# EAGLE design pmod-level-conv (EAGLE 7.7.0)
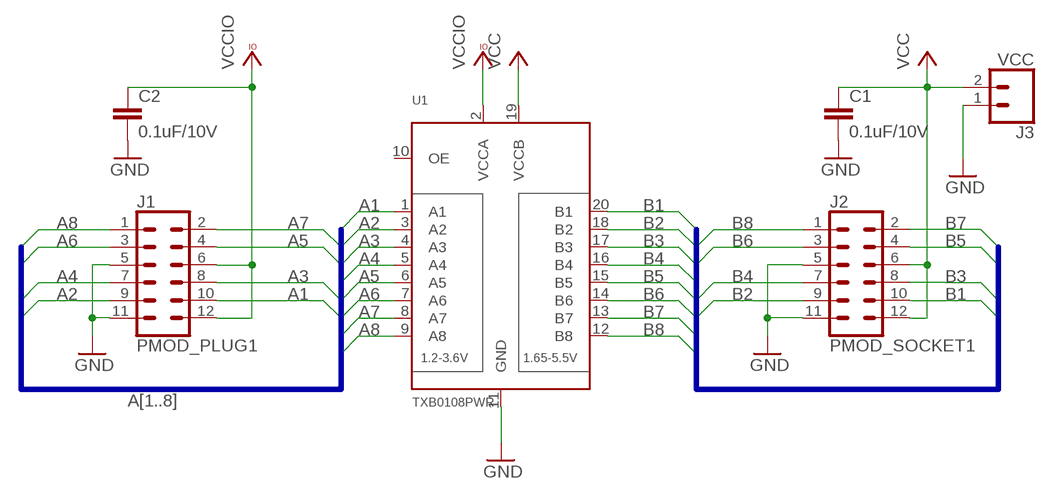
[diagram p0: schematic, sheet 1]

## Parts
C1  0.1uF/10V  C-EUC0603K  [C0603K]
C2  0.1uF/10V  C-EUC0603K  [C0603K]
J1  PMOD_PLUG1  CONN_06X2SMD_RA_PLUG  [2X6_SMD_RA_PLUG]
J2  PMOD_SOCKET1  CONN_06X2SMD_RA_SOCKET  [2X6_SMD_RA_SOCKET]
J3  VCC  CONN_02-JST-2MM-SMT  [JST-2-SMD]
U1  TXB0108PWR  [TSSOP20]

## Nets
A1: J1.10 U1.1(A1)
A2: J1.9 U1.3(A2)
A3: J1.8 U1.4(A3)
A4: J1.7 U1.5(A4)
A5: J1.4 U1.6(A5)
A6: J1.3 U1.7(A6)
A7: J1.2 U1.8(A7)
A8: J1.1 U1.9(A8)
B1: J2.10 U1.20(B1)
B2: J2.9 U1.18(B2)
B3: J2.8 U1.17(B3)
B4: J2.7 U1.16(B4)
B5: J2.4 U1.15(B5)
B6: J2.3 U1.14(B6)
B7: J2.2 U1.13(B7)
B8: J2.1 U1.12(B8)
GND: C1.2 C2.2 J1.5 J1.11 J2.5 J2.11 J3.1 U1.11(GND)
VCC: C1.1 J2.6 J2.12 J3.2 U1.19(VCCB)
VCCIO: C2.1 J1.6 J1.12 U1.2(VCCA)
Unconnected: U1.10(OE)

## Buses
A[1..8]
B[1..8]

## Library data of the parts
C1 C2 = rcl:C-EU: CAPACITOR, European symbol; SPICEPREFIX: C
J1 J2 = mechanical:CONN_06X2: Multi connection point. Often used as Generic Header-pin footprint for 0.1 inch spaced/style header connections On any of the 0.1 inch spaced packages, you can populate with these: Break Away Headers - Straight <https://www.sparkfun.com/products/116> (PRT-00116) Break Away Male Headers - Right Angle <https://www.sparkfun.com/products/553> (PRT-00553) Female Headers <https://www.sparkfun.com/products/115> (PRT-00115) Break Away Headers - Machine Pin <https://www.sparkfun.com/products/117> (PRT-00117) Break Away Female Headers - Swiss Machine Pin <https://www.sparkfun.com/products/743> (PRT-00743)
J3 = SparkFun-Connectors:CONN_02: Multi connection point. Often used as Generic Header-pin footprint for 0.1 inch spaced/style header connections On any of the 0.1 inch spaced packages, you can populate with these: Break Away Headers - Straight <https://www.sparkfun.com/products/116> (PRT-00116) Break Away Male Headers - Right Angle <https://www.sparkfun.com/products/553> (PRT-00553) Female Headers <https://www.sparkfun.com/products/115> (PRT-00115) Break Away Headers - Machine Pin <https://www.sparkfun.com/products/117> (PRT-00117) Break Away Female Headers - Swiss Machine Pin <https://www.sparkfun.com/products/743> (PRT-00743) For SCREWTERMINALS and SPRING TERMINALS visit here: Screw Terimnals on SparkFun.com <https://www.sparkfun.com/search/results?term=Screw+Terminals> (5mm/3.5mm/2.54mm spacing) This device is also useful as a general connection point to wire up your design to another part of your project. Our various solder wires solder well into these plated through hole pads. Hook-Up Wire - Assortment (Stranded, 22 AWG) <https://www.sparkfun.com/products/11375> (PRT-11375) Hook-Up Wire - Assortment (Solid Core, 22 AWG) <https://www.sparkfun.com/products/11367> (PRT-11367) View the entire wire category on our website here <https://www.sparkfun.com/categories/141> Special notes: Molex polarized connector foot print use with: PRT-08233 with associated crimp pins and housings. 2.54_SCREWTERM for use with PRT-10571. 3.5mm Screw Terminal footprints for PRT-08084 5mm Screw Terminal footprints for use with PRT-08432; PROD_ID: CONN-11443
U1 = semiconductors:TXB0108PWR: 8-Bit Bi-Directional Level Shifter 1.2V-3.6V (VCCA) to 1.65V-5.5V (VCCB) bi-directional level shifter with auto direction sensing. Max data rate - VCCA 1.8V: 20Mbps (50ns), VCCA 3.3V: 100Mbps (10ns) Digikey: 296-21527-1-ND

## Board
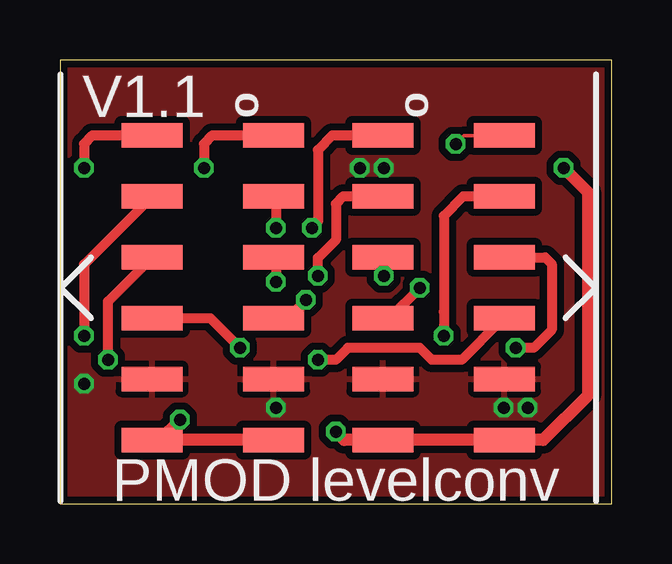
[diagram p1: board, top side]
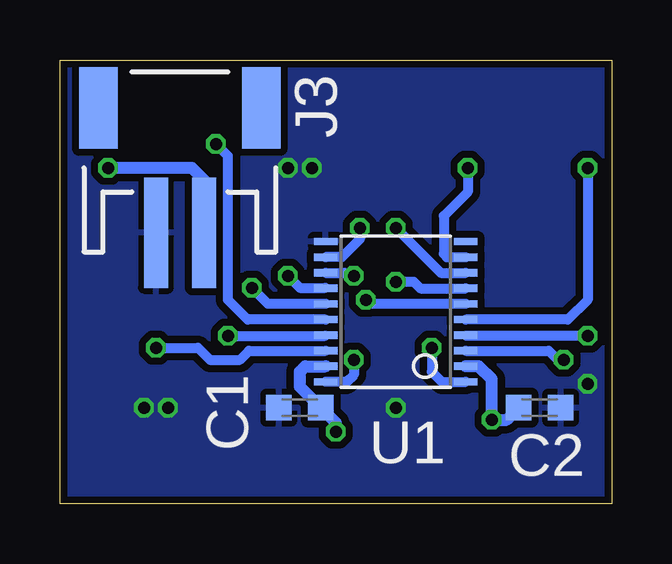
[diagram p2: board, bottom side, seen from below]

Size 23 x 18.5 mm. Coordinates in mm from the lower left corner, seen from the top.
Outline: 0,0 23,0 23,18.5 0,18.5 0,0
Copper layers (1*16): Top 0.035mm / dielectric 1.5mm / Bottom 0.035mm
Design rules "dirt_cheap_dirty_boards.v1.1": minimum track width 5mil, minimum drill 12mil, track to track 5mil, track to pad 5mil, pad to pad 5mil, via to via 5mil, smd to smd 0mil, copper to edge 10mil, drill to drill 10mil, minimum pad ring 10mil, minimum via ring 6mil, stop-mask expansion 2mil, vias tented up to drill 25mil, thermal gap 10mil

### Footprints (pad centres in the part's own frame; a part is rotated, then mirrored left to right if it is on the bottom)
C0603K = smd 1.05 x 1.08: 1 -0.875,0; 2 0.875,0
2X6_SMD_RA_PLUG = smd 1.016 x 2.54: 1 -6.35,2.54; 2 -3.81,2.54; 3 -1.27,2.54; 4 1.27,2.54; 5 3.81,2.54; 6 6.35,2.54; 7 -6.35,-2.54; 8 -3.81,-2.54; 9 -1.27,-2.54; 10 1.27,-2.54; 11 3.81,-2.54; 12 6.35,-2.54
2X6_SMD_RA_SOCKET = smd 1.016 x 2.54: 1 6.35,2.54; 2 3.81,2.54; 3 1.27,2.54; 4 -1.27,2.54; 5 -3.81,2.54; 6 -6.35,2.54; 7 6.35,-2.54; 8 3.81,-2.54; 9 1.27,-2.54; 10 -1.27,-2.54; 11 -3.81,-2.54; 12 -6.35,-2.54
JST-2-SMD = smd 1 x 4.6: 1 -1,-3.7; 2 1,-3.7 | smd 1.6 x 3.4: NC1 -3.4,1.5; NC2 3.4,1.5
TSSOP20 = smd 0.305 x 0.991: 1 -2.925,-2.918; 2 -2.275,-2.918; 3 -1.625,-2.918; 4 -0.975,-2.918; 5 -0.325,-2.918; 6 0.325,-2.918; 7 0.975,-2.918; 8 1.625,-2.918; 9 2.275,-2.918; 10 2.925,-2.918; 11 2.925,2.918; 12 2.275,2.918; 13 1.625,2.918; 14 0.975,2.918; 15 0.325,2.918; 16 -0.325,2.918; 17 -0.975,2.918; 18 -1.625,2.918; 19 -2.275,2.918; 20 -2.925,2.918

### Placement (x,y rotation side)
C1  13,4 180 bottom
C2  3,4 0 bottom
J1  6.38,9 270 top
J2  16,9 90 top
J3  18,15 0 bottom
U1  9,8 90 bottom

### Tracks (layer width: path | path; a pad name or v marks a point on that pad's centre or on a via)
A1  (via drill 0.5)
  Top 0.406: J1.10 6.27,7.73 v7.5,6.5
  Bottom 0.406: v7.5,6.5 7.5,5.5 7.08,5.08 U1.1
A2  (via drill 0.5)
  Top 0.406: v2,6 2,8.44 J1.9
  Bottom 0.15: 2.25,6 v2,6
  Bottom 0.406: U1.3 2.62,6.38 2.25,6
A3  (via drill 0.5)
  Top 0.406: J1.8 1,9.97 v1,7
  Bottom 0.15: 6.06,7 U1.4
  Bottom 0.406: v1,7 6.06,7
A4  (via drill 0.5)
  Top 0.406: J1.7 1.35,15.35 1,15 v1,14
  Bottom 0.406: v1,14 1,8.5 1.82,7.67 U1.5
A5  (via drill 0.5)
  Top 0.406: v10.25,8.5 9.48,7.73 J1.4
  Bottom 0.406: U1.6 10.07,8.32 v10.25,8.5
A6  (via drill 0.5)
  Top 0.15: J1.3 9,10.19
  Top 0.406: 9,10.19 v9,9.25
  Bottom 0.406: U1.7 7.97,8.97 8.25,9.25 v9,9.25
A7  (via drill 0.5)
  Top 0.15: J1.2 9,12.72
  Top 0.406: 9,12.72 v9,11.5
  Bottom 0.406: v9,11.5 7.12,9.62 U1.8
A8  (via drill 0.5)
  Top 0.406: J1.1 6.35,15.35 6,15 v6,14
  Bottom 0.406: v6,14 6,13 7,12 7,10.41 6.87,10.28 U1.9
B1  (via drill 0.5)
  Top 0.15: J2.10 18.41,7.6 18.35,7.6
  Top 0.406: v10.75,6 11.5,6 12,6.5 15,6.5 15.5,6 16.75,6 18.35,7.6
  Bottom 0.406: v10.75,6 10.75,5.38 11.05,5.08 U1.20
B2  (via drill 0.5)
  Top 0.406: J2.9 20.23,10.27 20.5,10 20.5,7.25 19.75,6.5 v19,6.5
  Bottom 0.406: v19,6.5 17.25,6.5 16.75,6 15.5,6 15.12,6.38 U1.18
B3  (via drill 0.5)
  Top 0.406: J2.8 16.81,12.81 16,12 16,8 v16,7
  Bottom 0.15: 11.94,7 U1.17
  Bottom 0.406: v16,7 11.94,7
B4  (via drill 0.5)
  Top 0.15: v16.5,15 16.85,15.35 J2.7
  Bottom 0.406: U1.16 15.18,7.67 16,8.5 16,14.5 v16.5,15
B5  (via drill 0.5)
  Top 0.15: 13.73,7.73 J2.4
  Top 0.406: v15,9 13.73,7.73
  Bottom 0.406: U1.15 14.32,8.32 v15,9
B6  (via drill 0.5)
  Top 0.406: v13.5,9.5 13.5,10.23 J2.3
  Bottom 0.15: 11.94,9 U1.14
  Bottom 0.406: v13.5,9.5 13,9 11.94,9
B7  (via drill 0.5)
  Top 0.406: J2.2 11.81,12.81 11.5,12.5 11.5,11 10.75,10.25 v10.75,9.5
  Bottom 0.406: U1.13 11.12,9.62 11,9.5 v10.75,9.5
B8  (via drill 0.5)
  Top 0.406: J2.1 11.35,15.35 10.75,14.75 10.75,11.75 v10.5,11.5
  Bottom 0.406: U1.12 11.25,10.28 10.5,11.02 v10.5,11.5
GND  (via drill 0.5)
  other vias: 1,5 9,4 19.5,4 18.5,4 13.5,14 12.5,14
  pour Bottom (isolate 0.305): 0,18.5 23,18.5 23,0 0,0
  pour Top (isolate 0.305): 0,18.5 23,18.5 23,0 0,0
VCC  (via drill 0.5)
  Top 0.508: v11.5,3 11.85,2.65 J2.6 J2.12 20.15,2.65 22,4.5 22,13 v21,14
  Bottom 0.406: J3.2 17,13.5
  Bottom 0.508: v11.5,3 11.5,3.38 C1.1 13,4.88 13,5.5 12.78,5.72 U1.19 | 17,13.5 17.5,14 v21,14
VCCIO  (via drill 0.5)
  Top 0.508: J1.6 J1.12 4.15,2.65 v5,3.5
  Bottom 0.508: C2.1 4.38,3.5 v5,3.5 5,5.18 5.55,5.72 U1.2

### Text on the board
tPlace: V1.1 | PMOD levelconv